# EAGLE schematic PCB-Schematic (EAGLE 8.3.1)
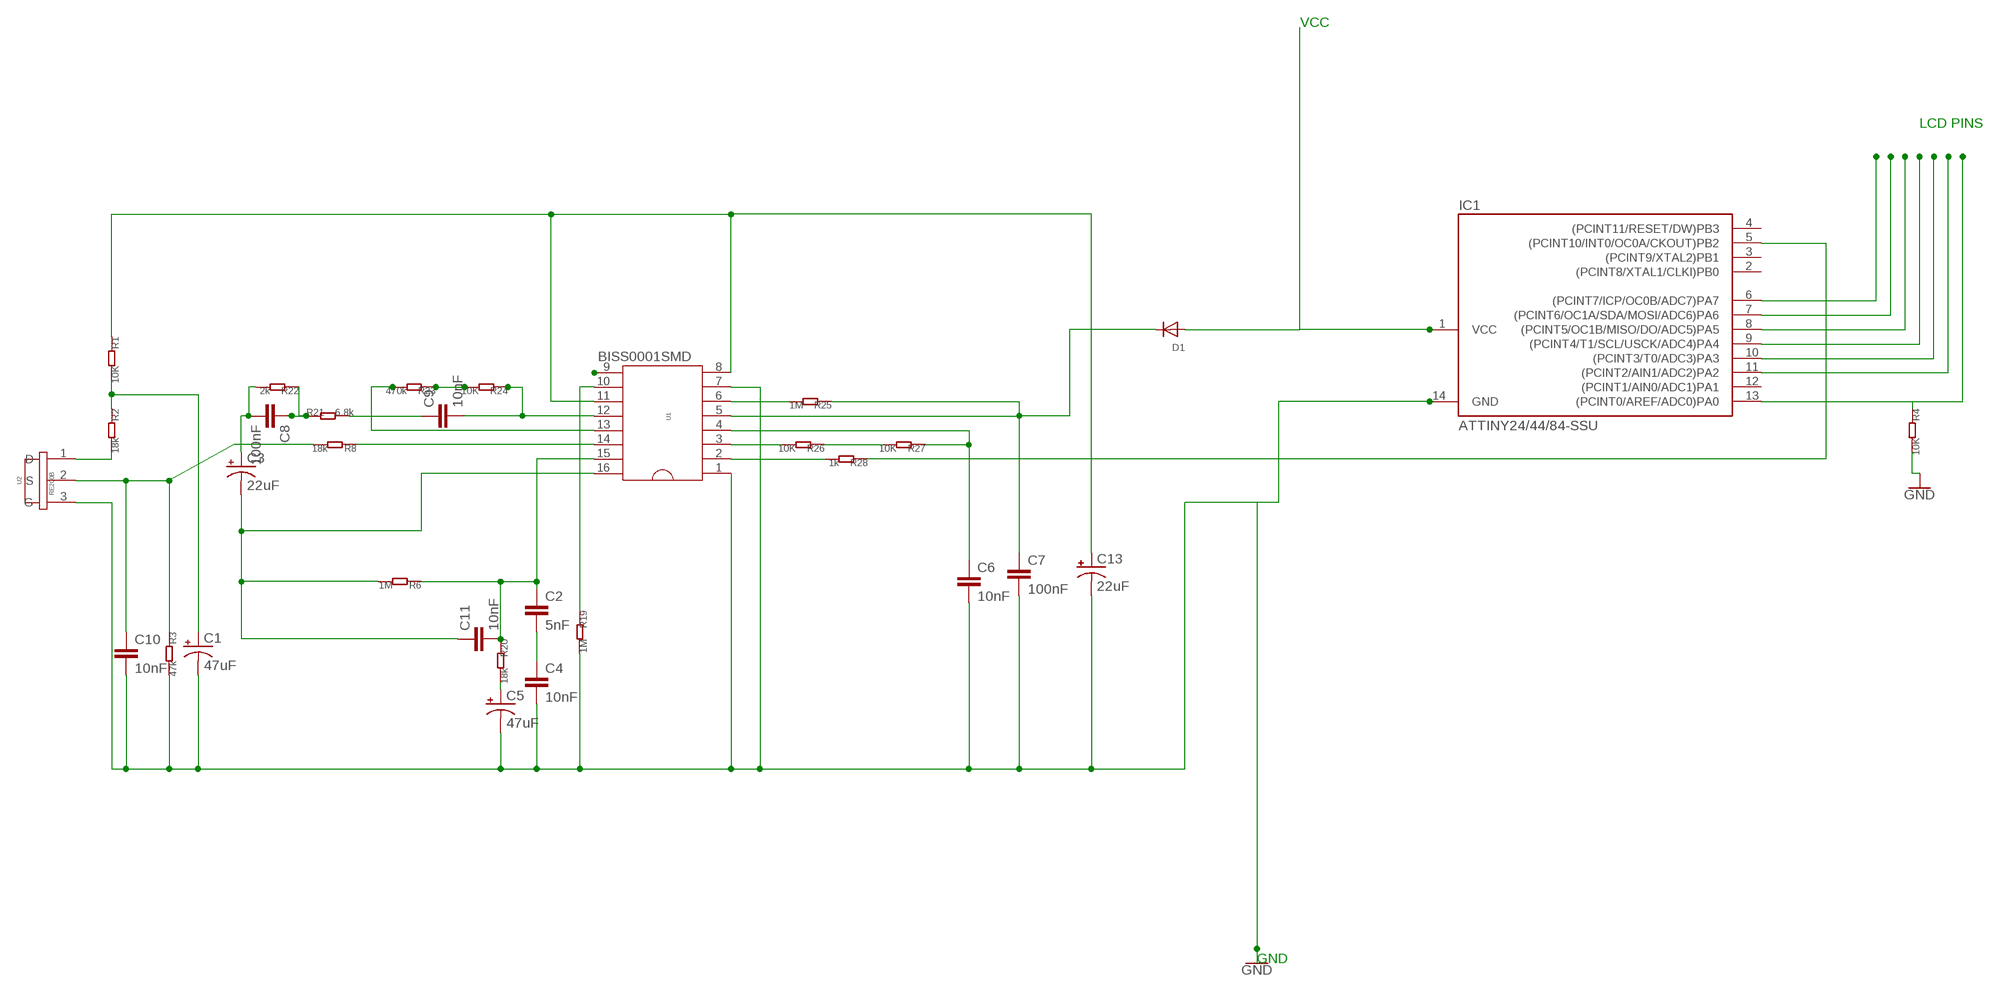
[diagram p0: schematic, sheet 1]

## Parts
C1  47uF  CPOL-US085CS-1W  [085CS_1W]
C2  5nF  C  [C0805]
C3  22uF  CPOL-US085CS-1W  [085CS_1W]
C4  10nF  C  [C0805]
C5  47uF  CPOL-US085CS-1W  [085CS_1W]
C6  10nF  C  [C0805]
C7  100nF  C  [C0805]
C8  100nF  C  [C0805]
C9  10nF  C  [C0805]
C10  10nF  C  [C0805]
C11  10nF  C  [C0805]
C13  22uF  CPOL-US085CS-1W  [085CS_1W]
D1  DIODESOD-323F  [SOD-323F]
IC1  ATTINY24/44/84-SSU  [SOIC14]
R1  10K  R-0603  [R0603]
R2  18k  R-0603  [R0603]
R3  47k  R-0603  [R0603]
R4  10K  R-0603  [R0603]
R6  1M  R-0603  [R0603]
R8  18k  R-0603  [R0603]
R19  1M  R-0603  [R0603]
R20  18k  R-0603  [R0603]
R21  6.8k  R-0603  [R0603]
R22  2k  R-0603  [R0603]
R23  470k  R-0603  [R0603]
R24  10K  R-0603  [R0603]
R25  1M  R-0603  [R0603]
R26  10K  R-0603  [R0603]
R27  10K  R-0603  [R0603]
R28  1k  R-0603  [R0603]
U1  BISS0001SMD  [SOP16]
U2  RE200B  [RE200B]

## Nets
GND: C1.- C4.2 C5.- C6.2 C7.2 C10.2 C13.- IC1.14(GND) R3.2 R4.2 R19.2 U1.1 U1.7 U2.3(G)
N$1: R2.2 U2.1(D)
N$2: C1.+ R1.2 R2.1
N$3: IC1.6((PCINT7/ICP/OC0B/ADC7)PA7)
N$4: R19.1 U1.10
N$6: IC1.7((PCINT6/OC1A/SDA/MOSI/ADC6)PA6)
N$7: R23.2 U1.13
N$8: R8.1 U1.14
N$9: C10.1 R3.1 R8.2 U2.2(S)
N$10: C3.- C11.1 R6.2 U1.16
N$11: C8.1 R21.1 R22.1
N$12: C9.1 R21.2
N$13: C5.+ R20.2
N$14: C2.1 C11.2 R6.1 R20.1 U1.15
N$15: C2.2 C4.1
N$16: R25.2 U1.6
N$17: R23.1 R24.2
N$18: C6.1 R27.1 U1.4
N$19: R26.2 U1.3
N$20: C7.1 D1.C R25.1 U1.5
N$21: C9.2 R24.1 U1.12
N$22: R28.2 U1.2
N$23: R26.1 R27.2
N$24: U1.9
N$25: IC1.5((PCINT10/INT0/OC0A/CKOUT)PB2) R28.1
N$26: C13.+ R1.1 U1.8 U1.11
N$27: C3.+ C8.2 R22.2
N$28: IC1.8((PCINT5/OC1B/MISO/DO/ADC5)PA5)
N$29: IC1.9((PCINT4/T1/SCL/USCK/ADC4)PA4)
N$30: IC1.10((PCINT3/T0/ADC3)PA3)
N$31: IC1.11((PCINT2/AIN1/ADC2)PA2)
N$33: D1.A IC1.1(VCC)
N$35: IC1.13((PCINT0/AREF/ADC0)PA0) R4.1
Unconnected: IC1.2((PCINT8/XTAL1/CLKI)PB0) IC1.3((PCINT9/XTAL2)PB1) IC1.4((PCINT11/RESET/DW)PB3) IC1.12((PCINT1/AIN0/ADC1)PA1)

## Notes on the sheet
- VCC
- LCD PINS
- GND

## Library data of the parts
C1 C3 C5 C13 = adafruit:CPOL-US: POLARIZED CAPACITOR, American symbol; OC_NEWARK: unknown
C2 C4 C6-C11 = eagle-ltspice:C: CAPACITOR, European symbol; OC_NEWARK: unknown; SPICEMODEL: NONE; SPICEPREFIX: C
D1 = adafruit:DIODE: Diode SMADIODE - SMA Surface Mount Package 20V 1A Schottky Diode Digikey: 641-1014-6-ND DO-1N4148 - Through Hole Small Current Diode SOD-123 20V 1 A (.5mV Vf) Schottky Diode - Digikey: MBRX120TPMSCT-ND SOD-323 10V 570mA (.38mV Vf, 3ns) Schottky Diode - Digikey: ZLLS410CT-ND SOD-523 30V 30mA Schottky Diode (RB751S-40TE61) - Digikey: RB751S-40TE61CT-ND SOT23-R/W - SOT23 Package (R = Solder Paste/Reflow Ovens, W = Hand-Soldering) BAT54Film 40V 300mA - Digikey: 497-7162-1-ND; OC_NEWARK: unknown
IC1 = attiny24_44_84:ATTINY24/44/84; OC_NEWARK: unknown
R1-R4 R6 R8 R19-R28 = Discrete:R*; OC_NEWARK: unknown
U1 = seeedleo:BISS0001SMD; OC_NEWARK: unknown
U2 = seeedleo:RE200B; OC_NEWARK: unknown